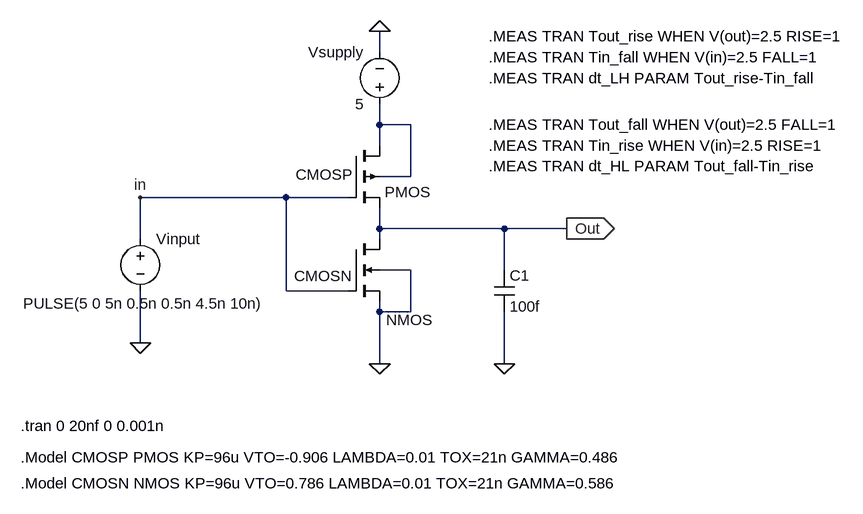
[diagram p0: schematic Inverter_paracitics.asc]
Inverter_paracitics.asc, the LTspice schematic file:
Version 4
SHEET 1 1984 752
WIRE 384 -80 384 -112
WIRE 384 32 384 0
WIRE 432 32 384 32
WIRE 384 64 384 32
WIRE 432 112 432 32
WIRE 432 112 384 112
WIRE 240 144 16 144
WIRE 336 144 240 144
WIRE 384 192 384 160
WIRE 576 192 384 192
WIRE 672 192 576 192
WIRE 16 208 16 144
WIRE 384 208 384 192
WIRE 432 256 384 256
WIRE 576 256 576 192
WIRE 240 288 240 144
WIRE 336 288 240 288
WIRE 384 320 384 304
WIRE 432 320 432 256
WIRE 432 320 384 320
WIRE 16 368 16 288
WIRE 384 400 384 320
WIRE 576 400 576 320
FLAG 384 400 0
FLAG 384 -112 0
FLAG 16 368 0
FLAG 672 192 Out
IOPIN 672 192 Out
FLAG 576 400 0
FLAG 16 144 in
SYMBOL pmos4 336 64 R0
WINDOW 0 -81 45 Left 2
SYMATTR InstName CMOSP
SYMATTR Value2 l=10u w=200u
SYMBOL nmos4 336 208 R0
WINDOW 0 -83 57 Left 2
WINDOW 3 58 125 Left 2
SYMATTR InstName CMOSN
SYMATTR Value2 l=10u w=100u
SYMBOL voltage 384 16 R180
WINDOW 0 24 96 Left 2
WINDOW 3 24 16 Left 2
WINDOW 123 0 0 Left 0
WINDOW 39 0 0 Left 0
SYMATTR InstName Vsupply
SYMATTR Value 5
SYMBOL voltage 16 192 R0
WINDOW 3 -180 115 Left 2
WINDOW 123 0 0 Left 0
WINDOW 39 0 0 Left 0
SYMATTR Value PULSE(5 0 5n 0.5n 0.5n 4.5n 10n)
SYMATTR InstName Vinput
SYMBOL cap 560 256 R0
SYMATTR InstName C1
SYMATTR Value 100f
TEXT -168 496 Left 2 !.tran 0 20nf 0 0.001n
TEXT -168 584 Left 2 !.Model CMOSN NMOS KP=96u VTO=0.786 LAMBDA=0.01 TOX=21n GAMMA=0.586
TEXT -168 544 Left 2 !.Model CMOSP PMOS KP=96u VTO=-0.906 LAMBDA=0.01 TOX=21n GAMMA=0.486
TEXT 552 -104 Left 2 !.MEAS TRAN Tout_rise WHEN V(out)=2.5 RISE=1
TEXT 552 -72 Left 2 !.MEAS TRAN Tin_fall WHEN V(in)=2.5 FALL=1
TEXT 552 -40 Left 2 !.MEAS TRAN dt_LH PARAM Tout_rise-Tin_fall
TEXT 552 32 Left 2 !.MEAS TRAN Tout_fall WHEN V(out)=2.5 FALL=1
TEXT 552 64 Left 2 !.MEAS TRAN Tin_rise WHEN V(in)=2.5 RISE=1
TEXT 552 96 Left 2 !.MEAS TRAN dt_HL PARAM Tout_fall-Tin_rise

The netlist it stands for:
* Inverter_paracitics.asc
M§CMOSP N001 in Out N001 PMOS l=10u w=200u
M§CMOSN Out in 0 0 NMOS l=10u w=100u
Vsupply N001 0 5
Vinput in 0 PULSE(5 0 5n 0.5n 0.5n 4.5n 10n)
C1 Out 0 100f
.model NMOS NMOS
.model PMOS PMOS
.lib standard.mos
.tran 0 20nf 0 0.001n
.Model CMOSN NMOS KP=96u VTO=0.786 LAMBDA=0.01 TOX=21n GAMMA=0.586
.Model CMOSP PMOS KP=96u VTO=-0.906 LAMBDA=0.01 TOX=21n GAMMA=0.486
.MEAS TRAN Tout_rise WHEN V(out)=2.5 RISE=1
.MEAS TRAN Tin_fall WHEN V(in)=2.5 FALL=1
.MEAS TRAN dt_LH PARAM Tout_rise-Tin_fall
.MEAS TRAN Tout_fall WHEN V(out)=2.5 FALL=1
.MEAS TRAN Tin_rise WHEN V(in)=2.5 RISE=1
.MEAS TRAN dt_HL PARAM Tout_fall-Tin_rise
.backanno
.end